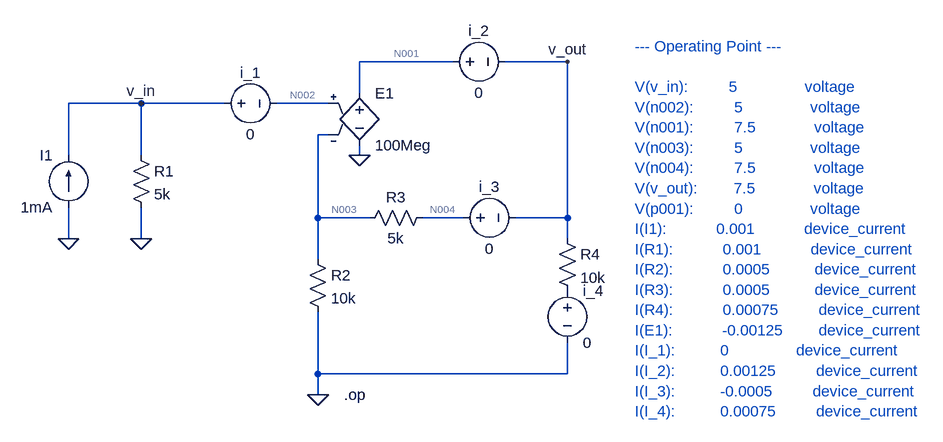
[diagram p0: schematic Q2.asc]
Q2.asc, the LTspice schematic file:
Version 4
SHEET 1 1164 680
WIRE 400 -64 256 -64
WIRE 576 -64 480 -64
WIRE 256 -16 256 -64
WIRE -80 0 -192 0
WIRE 48 0 -80 0
WIRE 208 0 128 0
WIRE 208 48 192 48
WIRE -192 80 -192 0
WIRE -80 80 -80 0
WIRE 256 80 256 64
WIRE 192 176 192 48
WIRE 272 176 192 176
WIRE 416 176 352 176
WIRE 576 176 576 -64
WIRE 576 176 496 176
WIRE -192 208 -192 160
WIRE -80 208 -80 160
WIRE 576 208 576 176
WIRE 192 240 192 176
WIRE 192 416 192 320
WIRE 576 416 576 368
WIRE 576 416 192 416
WIRE 192 448 192 416
FLAG -192 208 0
FLAG -80 208 0
FLAG 256 80 0
FLAG 576 -64 v_out
FLAG 192 448 0
FLAG -80 0 v_in
SYMBOL current -192 160 R180
WINDOW 0 24 80 Left 2
WINDOW 3 24 0 Left 2
SYMATTR InstName I1
SYMATTR Value 1mA
SYMBOL res -96 64 R0
SYMATTR InstName R1
SYMATTR Value 5k
SYMBOL voltage 32 0 R270
WINDOW 0 32 56 VTop 2
WINDOW 3 -32 56 VBottom 2
SYMATTR InstName i_1
SYMATTR Value 0
SYMBOL e 256 -32 R0
SYMATTR InstName E1
SYMATTR Value 100Meg
SYMBOL res 176 224 R0
SYMATTR InstName R2
SYMATTR Value 10k
SYMBOL res 368 160 R90
WINDOW 0 0 56 VBottom 2
WINDOW 3 32 56 VTop 2
SYMATTR InstName R3
SYMATTR Value 5k
SYMBOL voltage 384 -64 R270
WINDOW 0 32 56 VTop 2
WINDOW 3 -32 56 VBottom 2
SYMATTR InstName i_2
SYMATTR Value 0
SYMBOL voltage 400 176 R270
WINDOW 0 32 56 VTop 2
WINDOW 3 -32 56 VBottom 2
SYMATTR InstName i_3
SYMATTR Value 0
SYMBOL res 560 192 R0
SYMATTR InstName R4
SYMATTR Value 10k
SYMBOL voltage 576 272 R0
SYMATTR InstName i_4
SYMATTR Value 0
TEXT 232 448 Left 2 !.op
TEXT 680 -88 Left 2 ;--- Operating Point ---\n \nV(v_in):         5               voltage\nV(n002):         5               voltage\nV(n001):         7.5             voltage\nV(n003):         5               voltage\nV(n004):         7.5             voltage\nV(v_out):        7.5             voltage\nV(p001):         0               voltage\nI(I1):           0.001           device_current\nI(R1):           0.001           device_current\nI(R2):           0.0005          device_current\nI(R3):           0.0005          device_current\nI(R4):           0.00075         device_current\nI(E1):           -0.00125        device_current\nI(I_1):          0               device_current\nI(I_2):          0.00125         device_current\nI(I_3):          -0.0005         device_current\nI(I_4):          0.00075         device_current

The netlist it stands for:
* Q2.asc
I1 0 v_in 1mA
R1 v_in 0 5k
V§i_1 v_in N002 0
E1 N001 0 N002 N003 100Meg
R2 N003 0 10k
R3 N004 N003 5k
V§i_2 N001 v_out 0
V§i_3 N004 v_out 0
R4 v_out P001 10k
V§i_4 P001 0 0
.op
* --- Operating Point ---
* V(v_in):         5               voltage
* V(n002):         5               voltage
* V(n001):         7.5             voltage
* V(n003):         5               voltage
* V(n004):         7.5             voltage
* V(v_out):        7.5             voltage
* V(p001):         0               voltage
* I(I1):           0.001           device_current
* I(R1):           0.001           device_current
* I(R2):           0.0005          device_current
* I(R3):           0.0005          device_current
* I(R4):           0.00075         device_current
* I(E1):           -0.00125        device_current
* I(I_1):          0               device_current
* I(I_2):          0.00125         device_current
* I(I_3):          -0.0005         device_current
* I(I_4):          0.00075         device_current
.backanno
.end

* Results of the author's LTspice run, read from the files saved beside the schematic
* Operating Point:
*   V(v_in) = 5 V
*   V(n002) = 5 V
*   V(n001) = 7.5 V
*   V(n003) = 5 V
*   V(n004) = 7.5 V
*   V(v_out) = 7.5 V
*   V(p001) = 0 V
*   I(I1) = 1 mA
*   I(R1) = 1 mA
*   I(R2) = 500 µA
*   I(R3) = 500 µA
*   I(R4) = 750 µA
*   I(E1) = -1.25 mA
*   I(I_1) = 0 A
*   I(I_2) = 1.25 mA
*   I(I_3) = -500 µA
*   I(I_4) = 750 µA